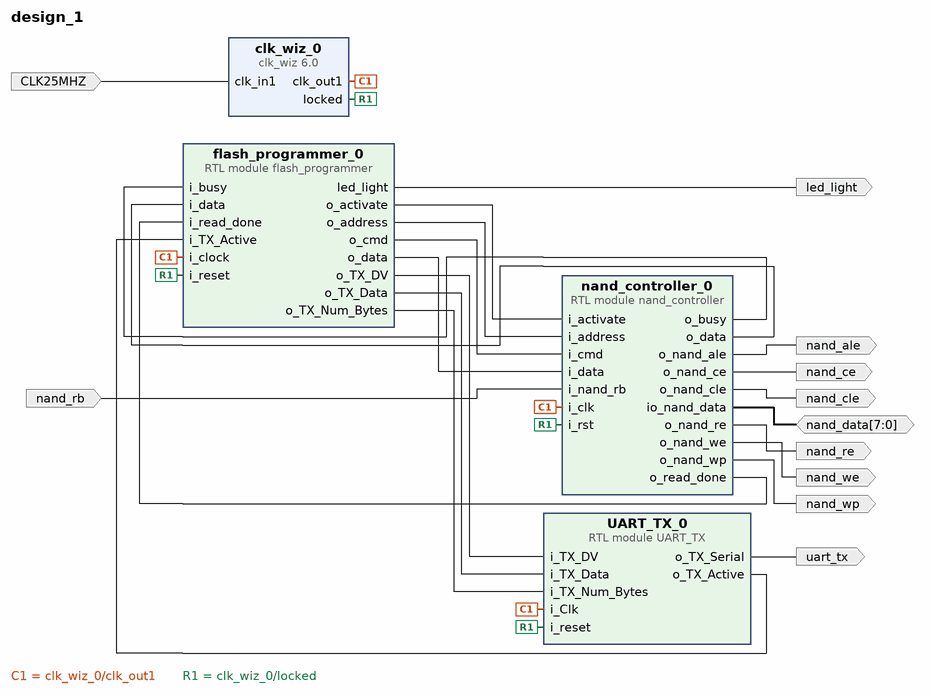
[diagram p0: block diagram of the top level]
# Vivado block design design_1, xck26-sfvc784-2LV-c, Vivado 2025.1
create_bd_design design_1

create_bd_port -dir I nand_rb
create_bd_port -dir O nand_re
create_bd_port -dir O nand_ale
create_bd_port -dir O nand_wp
create_bd_port -dir O nand_we
create_bd_port -dir O nand_cle
create_bd_port -dir O led_light
create_bd_port -dir I -type clk CLK25MHZ
set_property -dict {CONFIG.FREQ_HZ 25000000} [get_bd_ports CLK25MHZ]
create_bd_port -dir O uart_tx
create_bd_port -dir O nand_ce
create_bd_port -dir IO -from 7 -to 0 -type data nand_data

create_bd_cell -type module -reference flash_programmer flash_programmer_0
create_bd_cell -type module -reference UART_TX UART_TX_0
create_bd_cell -type ip -vlnv xilinx.com:ip:clk_wiz:6.0 clk_wiz_0
set_property -dict [list \
  CONFIG.AUTO_PRIMITIVE MMCM \
  CONFIG.CLKIN1_JITTER_PS 400.0 \
  CONFIG.CLKOUT1_DRIVES Buffer \
  CONFIG.CLKOUT1_JITTER 190.517 \
  CONFIG.CLKOUT1_PHASE_ERROR 222.305 \
  CONFIG.CLKOUT1_REQUESTED_OUT_FREQ 100.00 \
  CONFIG.CLKOUT2_DRIVES Buffer \
  CONFIG.CLKOUT3_DRIVES Buffer \
  CONFIG.CLKOUT4_DRIVES Buffer \
  CONFIG.CLKOUT5_DRIVES Buffer \
  CONFIG.CLKOUT6_DRIVES Buffer \
  CONFIG.CLKOUT7_DRIVES Buffer \
  CONFIG.FEEDBACK_SOURCE FDBK_AUTO \
  CONFIG.MMCM_BANDWIDTH OPTIMIZED \
  CONFIG.MMCM_CLKFBOUT_MULT_F 48.000 \
  CONFIG.MMCM_CLKIN1_PERIOD 40.000 \
  CONFIG.MMCM_CLKIN2_PERIOD 10.0 \
  CONFIG.MMCM_CLKOUT0_DIVIDE_F 12.000 \
  CONFIG.MMCM_COMPENSATION AUTO \
  CONFIG.OPTIMIZE_CLOCKING_STRUCTURE_EN true \
  CONFIG.PRIMITIVE Auto \
  CONFIG.PRIM_IN_FREQ 25.000 \
  CONFIG.USE_LOCKED true \
  CONFIG.USE_RESET false \
] [get_bd_cells clk_wiz_0]
create_bd_cell -type module -reference nand_controller nand_controller_0

# ---- connections ----

connect_bd_net [get_bd_ports CLK25MHZ] [get_bd_pins clk_wiz_0/clk_in1]
connect_bd_net [get_bd_ports nand_data] [get_bd_pins nand_controller_0/io_nand_data]
connect_bd_net [get_bd_pins UART_TX_0/o_TX_Active] [get_bd_pins flash_programmer_0/i_TX_Active]
connect_bd_net [get_bd_pins UART_TX_0/o_TX_Serial] [get_bd_ports uart_tx]
connect_bd_net [get_bd_pins clk_wiz_0/clk_out1] \
  [get_bd_pins nand_controller_0/i_clk] [get_bd_pins UART_TX_0/i_Clk] [get_bd_pins flash_programmer_0/i_clock]
connect_bd_net [get_bd_pins clk_wiz_0/locked] \
  [get_bd_pins nand_controller_0/i_rst] [get_bd_pins UART_TX_0/i_reset] [get_bd_pins flash_programmer_0/i_reset]
connect_bd_net -net flash_programmer_0_i_TX_DV [get_bd_pins flash_programmer_0/o_TX_DV] [get_bd_pins UART_TX_0/i_TX_DV]
connect_bd_net [get_bd_pins flash_programmer_0/led_light] [get_bd_ports led_light]
connect_bd_net [get_bd_pins flash_programmer_0/o_TX_Data] [get_bd_pins UART_TX_0/i_TX_Data]
connect_bd_net [get_bd_pins flash_programmer_0/o_TX_Num_Bytes] [get_bd_pins UART_TX_0/i_TX_Num_Bytes]
connect_bd_net [get_bd_pins flash_programmer_0/o_activate] [get_bd_pins nand_controller_0/i_activate]
connect_bd_net [get_bd_pins flash_programmer_0/o_address] [get_bd_pins nand_controller_0/i_address]
connect_bd_net [get_bd_pins flash_programmer_0/o_cmd] [get_bd_pins nand_controller_0/i_cmd]
connect_bd_net [get_bd_pins flash_programmer_0/o_data] [get_bd_pins nand_controller_0/i_data]
connect_bd_net [get_bd_pins nand_controller_0/o_busy] [get_bd_pins flash_programmer_0/i_busy]
connect_bd_net [get_bd_pins nand_controller_0/o_data] [get_bd_pins flash_programmer_0/i_data]
connect_bd_net [get_bd_pins nand_controller_0/o_nand_ale] [get_bd_ports nand_ale]
connect_bd_net [get_bd_pins nand_controller_0/o_nand_ce] [get_bd_ports nand_ce]
connect_bd_net [get_bd_pins nand_controller_0/o_nand_cle] [get_bd_ports nand_cle]
connect_bd_net [get_bd_pins nand_controller_0/o_nand_re] [get_bd_ports nand_re]
connect_bd_net [get_bd_pins nand_controller_0/o_nand_we] [get_bd_ports nand_we]
connect_bd_net [get_bd_pins nand_controller_0/o_nand_wp] [get_bd_ports nand_wp]
connect_bd_net [get_bd_pins nand_controller_0/o_read_done] [get_bd_pins flash_programmer_0/i_read_done]
connect_bd_net -net nand_rnb_1 [get_bd_ports nand_rb] [get_bd_pins nand_controller_0/i_nand_rb]

validate_bd_design
save_bd_design
